# EAGLE design iron (EAGLE 9.3.0)
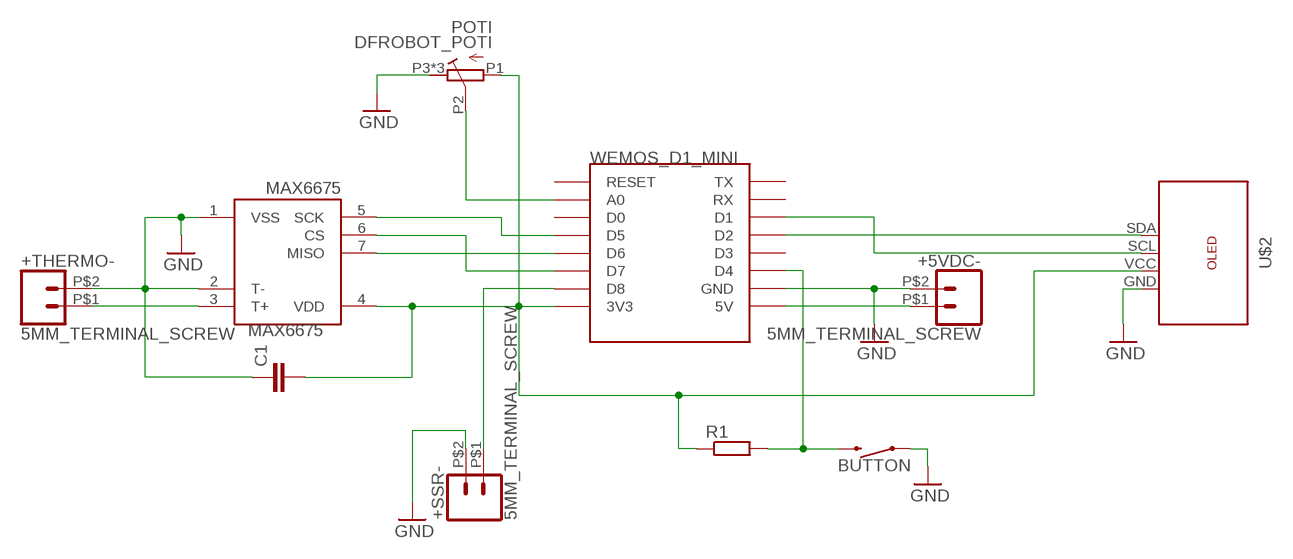
[diagram p0: schematic, sheet 1]

## Parts
+5VDC-  5MM_TERMINAL_SCREW  [5MM_TERMINAL_SCREW]
+SSR-  5MM_TERMINAL_SCREW  [5MM_TERMINAL_SCREW]
+THERMO-  5MM_TERMINAL_SCREW  [5MM_TERMINAL_SCREW]
BUTTON  MOMENTARY-SWITCH-SPST-PTH-12MM  [TACTILE_SWITCH_PTH_12MM]
C1  C-EUC0603  [C0603]
MAX6675  MAX6675  [SO08]
POTI  DFROBOT_POTI  [DFROBOT_POTI]
R1  R-EU_R0603  [R0603]
U$2  OLED128X64  [OLED_128X64]
WEMOS_D1_MINI  WEMOS-D1-MINI  [WEMOS-D1-MINI]

## Nets
GND: +5VDC-.P$2 +SSR-.P$2 +THERMO-.P$2 BUTTON.1 C1.1 MAX6675.1(VSS) MAX6675.2(T-) POTI.P3(E) POTI.PG1(E) POTI.PG2(E) U$2.GND WEMOS_D1_MINI.GND
N$1: MAX6675.5(SCK) WEMOS_D1_MINI.D5
N$2: MAX6675.6(CS) WEMOS_D1_MINI.D7
N$3: MAX6675.7(MISO) WEMOS_D1_MINI.D6
N$4: C1.2 MAX6675.4(VDD) POTI.P1(A) R1.1 U$2.VCC WEMOS_D1_MINI.3V3
N$5: U$2.SCL WEMOS_D1_MINI.D1
N$6: U$2.SDA WEMOS_D1_MINI.D2
N$7: +SSR-.P$1 WEMOS_D1_MINI.D8
N$8: +THERMO-.P$1 MAX6675.3(T+)
N$9: +5VDC-.P$1 WEMOS_D1_MINI.5V
N$11: BUTTON.3 R1.2 WEMOS_D1_MINI.D4
N$12: POTI.P2(S) WEMOS_D1_MINI.A0
Unconnected: WEMOS_D1_MINI.D0 WEMOS_D1_MINI.D3 WEMOS_D1_MINI.RESET WEMOS_D1_MINI.RX WEMOS_D1_MINI.TX

## Library data of the parts
+5VDC- +SSR- +THERMO- = moekoe:5MM_TERMINAL_SCREW
BUTTON = SparkFun-Switches:MOMENTARY-SWITCH-SPST: Momentary Switch (Pushbutton) - SPST Normally-open (NO) SPST momentary switches (buttons, pushbuttons). Variants PTH-12MM - 12mm square, through-hole Momentary Pushbutton Switch - 12mm Square <https://www.sparkfun.com/products/9190> (COM-09190) PTH-6.0MM, PTH-6.0MM-KIT - 6.0mm square, through-hole Mini Pushbutton Switch <https://www.sparkfun.com/products/97> (COM-00097) KIT package intended for soldering kit's - only one side of pads' copper is exposed. PTH-RIGHT-ANGLE-KIT - Right-angle, through-hole Right Angle Tactile Button <https://www.sparkfun.com/products/10791> - Used on SparkFun BigTime Watch Kit <https://www.sparkfun.com/products/11734> SMD-12MM - 12mm square, surface-mount Tactile Button - SMD (12mm) <https://www.sparkfun.com/products/12993> (COM-12993) Used on SparkFun PicoBoard <https://www.sparkfun.com/products/11888> SMD-4.5MM - 4.5mm Square Trackball Switch Used on SparkFun Blackberry Trackballer Breakout <https://www.sparkfun.com/products/13169> SMD-4.6MMX2.8MM - 4.60mm x 2.80mm, surface mount Used on SparkFun SAMD21 Mini Breakout <https://www.sparkfun.com/products/13664> SMD-5.2MM, SMD-5.2-REDUNDANT - 5.2mm square, surface-mount Mini Pushbutton Switch - SMD <https://www.sparkfun.com/products/8720> (COM-08720) Used on Arduino Pro Mini <https://www.sparkfun.com/products/11114> REDUNDANT package connects both switch circuits together SMD-6.0X3.5MM - 6.0 x 3.5mm, surface mount Momentary Reset Switch SMD <https://www.sparkfun.com/products/8229> (COM-08229) SMD-6.2MM-TALL - 6.2mm square, surface mount Tactile Button - SMD (6mm) <https://www.sparkfun.com/products/12992> Used on SparkFun Digital Sandbox <https://www.sparkfun.com/products/12651> SMD-RIGHT-ANGLE - Right-angle, surface mount Used on SparkFun Block for Intel® Edison - Arduino <https://www.sparkfun.com/products/13036>; PROD_ID: SWCH-09185; SF_SKU: COM-09190
C1 = rcl:C-EU: CAPACITOR, European symbol; SPICEPREFIX: C
MAX6675 = max6675:MAX6675
POTI = moekoe:DFROBOT_POTI
R1 = rcl:R-EU_: RESISTOR, European symbol; SPICEPREFIX: R
U$2 = moekoe:OLED128X64
WEMOS_D1_MINI = esp8266modules:WEMOS-D1-MINI: WeMos.cc D1 mini ESP8266 module

## Board
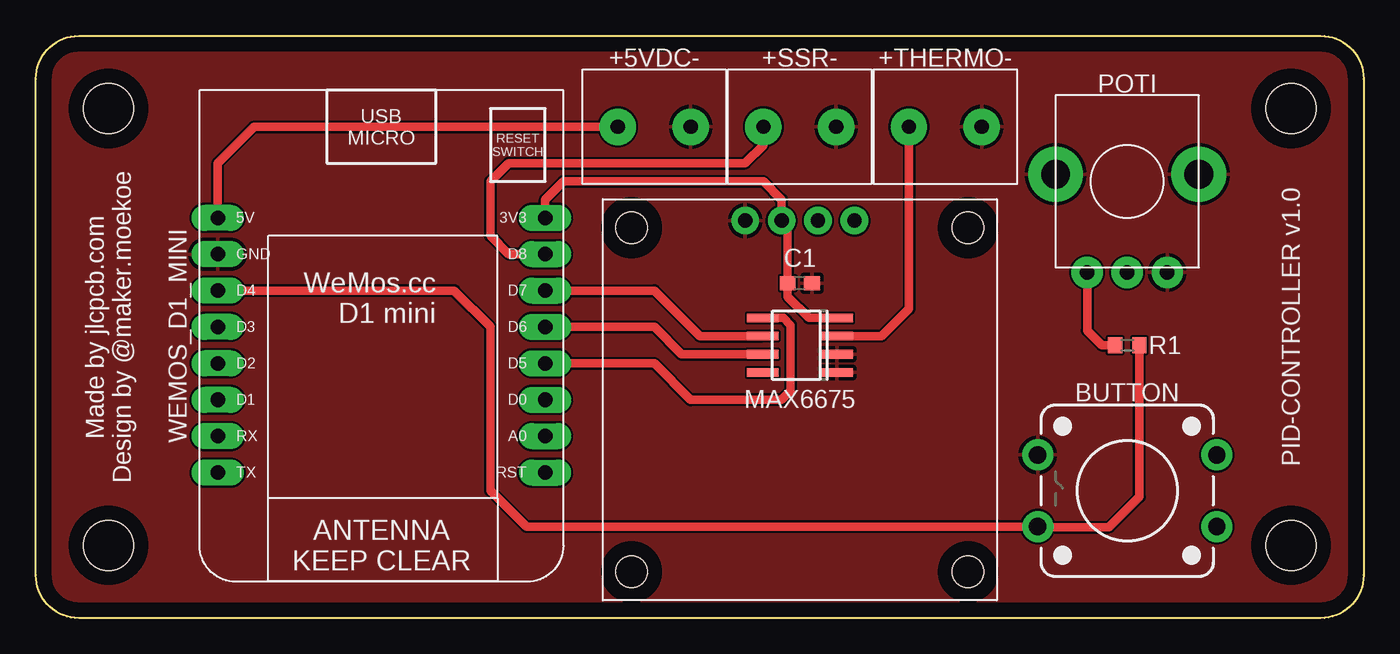
[diagram p1: board, top side]
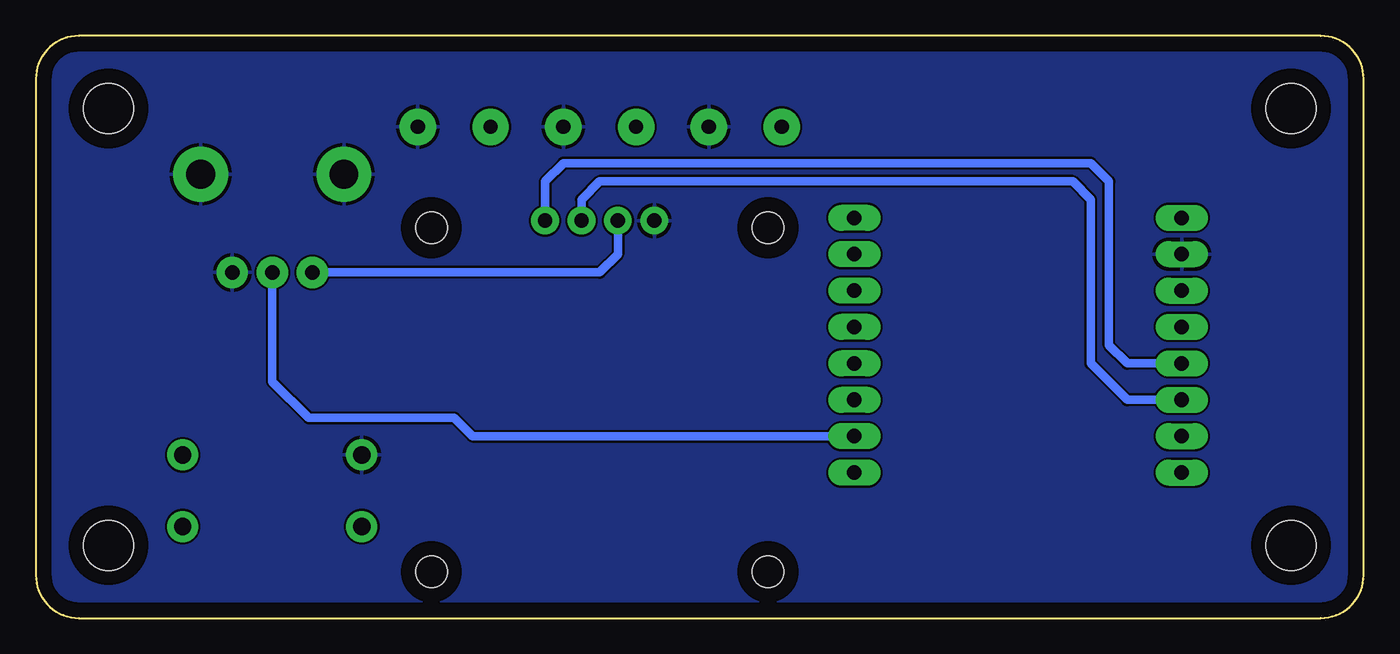
[diagram p2: board, bottom side, seen from below]

Size 92.71 x 40.64 mm. Coordinates in mm from the lower left corner, seen from the top.
Outline: 92.71,37.64 92.71,3 arc-90 89.71,0 3,0 arc-90 0,3 0,37.64 arc-90 3,40.64 89.71,40.64 arc-90 92.71,37.64
Copper layers (1*16): Top 0.035mm / dielectric 1.5mm / Bottom 0.035mm
Design rules "default": minimum track width 6mil, minimum drill 0.35mm, track to track 6mil, track to pad 6mil, pad to pad 6mil, via to via 6mil, smd to smd 6mil, copper to edge 40mil, drill to drill 6mil, minimum pad ring 10mil, minimum via ring 8mil, stop-mask expansion 4mil, vias tented up to drill 0mil, thermal gap 10mil
Holes 3.5 mm at 5.08,35.56 5.08,5.08 87.63,5.08 87.63,35.56

### Footprints (pad centres in the part's own frame; a part is rotated, then mirrored left to right if it is on the bottom)
5MM_TERMINAL_SCREW = drill 1 pad 2.54: P$1 -2.54,0; P$2 2.54,0
TACTILE_SWITCH_PTH_12MM = drill 1.2 pad 2.159: 1 6.25,-2.5; 2 -6.25,-2.5; 3 6.25,2.5; 4 -6.25,2.5
C0603 = smd 1.1 x 1: 1 -0.85,0; 2 0.85,0
SO08 = smd 0.6 x 2.2: 1 -1.905,-2.6; 2 -0.635,-2.6; 3 0.635,-2.6; 4 1.905,-2.6; 5 1.905,2.6; 6 0.635,2.6; 7 -0.635,2.6; 8 -1.905,2.6
DFROBOT_POTI = drill 1 pad 2.184: P1 -2.794,-6.35; P2 0,-6.35; P3 2.794,-6.35 | drill 2 pad 3.81: PG1 -5,0.5; PG2 5,0.5
R0603 = smd 1 x 1.1: 1 -0.85,0; 2 0.85,0
OLED_128X64 = drill 1 pad 1.93: GND -3.81,12.5; SCL 1.27,12.5; SDA 3.81,12.5; VCC -1.27,12.5 | hole 2.2: -11.75,12; 11.75,12; 11.75,-12; -11.75,-12
WEMOS-D1-MINI = drill 1.016 pad 1.829 long: 3V3 -10.16,-10.16; 5V 12.7,-10.16; A0 -10.16,5.08; D0 -10.16,2.54; D1 12.7,2.54; D2 12.7,0; D3 12.7,-2.54; D4 12.7,-5.08; D5 -10.16,0; D6 -10.16,-2.54; D7 -10.16,-5.08; D8 -10.16,-7.62; GND 12.7,-7.62; RESET -10.16,7.62; RX 12.7,5.08; TX 12.7,7.62

### Placement (x,y rotation side)
+5VDC-  43.18,34.29 0 top
+SSR-  53.34,34.29 0 top
+THERMO-  63.5,34.29 0 top
BUTTON  76.2,8.89 180 top
C1  53.34,23.37 180 top
MAX6675  53.34,19.05 90 top
POTI  76.2,30.48 0 top
R1  76.2,19.05 0 top
U$2  53.34,15.24 0 top
WEMOS_D1_MINI  25.4,17.78 180 top

### Tracks (layer width: path | path; a pad name or v marks a point on that pad's centre or on a via)
GND
  pour Top: -1.27,41.91 -1.27,-1.27 93.98,-1.27 93.98,41.91
  pour Bottom: -1.27,41.91 -1.27,-1.27 93.98,-1.27 93.98,41.91
N$1
  Top 0.61: WEMOS_D1_MINI.D5 43.18,17.78 45.72,15.24 52.07,15.24 52.7,15.88 52.7,20.45 52.2,20.95 MAX6675.5
N$2
  Top 0.61: MAX6675.6 46.35,19.68 43.18,22.86 WEMOS_D1_MINI.D7
N$3
  Top 0.61: WEMOS_D1_MINI.D6 43.18,20.32 45.09,18.41 MAX6675.7
N$4
  Top 0.61: WEMOS_D1_MINI.3V3 35.56,29.21 36.83,30.48 50.8,30.48 52.07,29.21 U$2.VCC 52.49,27.32 C1.2 52.49,22.44 53.98,20.95 MAX6675.4 | POTI.P1 73.41,20.07 74.42,19.05 R1.1
  Bottom 0.61: U$2.VCC 52.07,25.4 53.34,24.13 POTI.P1
N$5
  Bottom 0.61: WEMOS_D1_MINI.D1 16.51,15.24 19.05,17.78 19.05,29.21 20.32,30.48 53.34,30.48 54.61,29.21 U$2.SCL
N$6
  Bottom 0.61: WEMOS_D1_MINI.D2 16.51,17.78 17.78,19.05 17.78,30.48 19.05,31.75 55.88,31.75 57.15,30.48 U$2.SDA
N$7
  Top 0.61: WEMOS_D1_MINI.D8 33.02,25.4 31.75,26.67 31.75,30.48 33.02,31.75 49.53,31.75 50.8,33.02 +SSR-.P$1
N$8
  Top 0.61: +THERMO-.P$1 60.96,21.59 59.05,19.68 MAX6675.3
N$9
  Top 0.61: WEMOS_D1_MINI.5V 12.7,31.75 15.24,34.29 +5VDC-.P$1
N$11
  Top 0.61: R1.2 77.05,8.47 74.93,6.35 69.99,6.35 BUTTON.3 34.25,6.39 31.75,8.89 31.75,20.32 29.21,22.86 WEMOS_D1_MINI.D4
N$12
  Bottom 0.61: POTI.P2 76.2,16.51 73.66,13.97 63.5,13.97 62.23,12.7 WEMOS_D1_MINI.A0

### Text on the board
tNames: Made by jlcpcb.com / Design by @maker.moekoe | PID-CONTROLLER v1.0